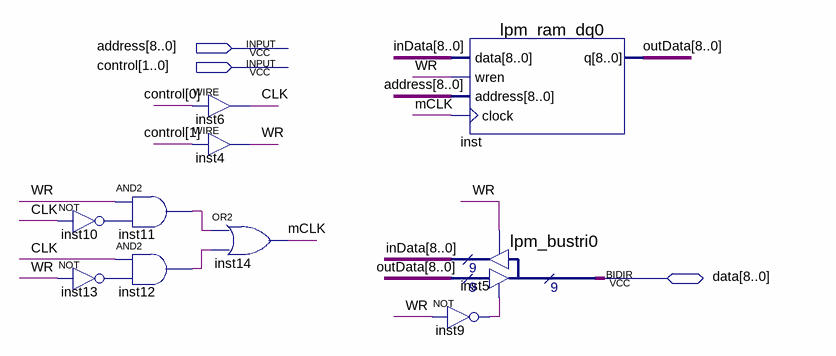
[diagram p0: schematic sheet]
// Quartus schematic RAM.bdf as structural Verilog: 10 symbols, 3 pins
module RAM (
  input  [8:0] address,
  input  [1:0] control,
  inout  [8:0] data
);

  wire CLK, inst9_out, inst10_out, inst11_out, inst12_out, inst13_out, mCLK, WR;
  wire [8:0] inData, outData;

  not inst10 (inst10_out, CLK);
  not inst13 (inst13_out, WR);
  and inst11 (inst11_out, WR, inst10_out);
  and inst12 (inst12_out, CLK, inst13_out);
  assign CLK = control[0];  // WIRE inst6
  assign WR = control[1];  // WIRE inst4
  or inst14 (mCLK, inst11_out, inst12_out);
  lpm_ram_dq0 inst (.data(inData), .wren(WR), .address(address), .clock(mCLK), .q(outData));
  lpm_bustri0 inst5 (.enabledt(inst9_out), .data(outData), .enabletr(WR), .result(inData), .tridata(data));
  not inst9 (inst9_out, WR);
endmodule
